# Altium schematic sheet 07_Hardware_ID.SchDoc: -
size A4; Date: -; ApprovedBy: -; CheckedBy: -; Author: -; CompanyName: -; DrawnBy: -; Engineer: -; Organization: Komax AG; Address1: -; Address2: -; Address3: -; Address4: -; DocumentNumber: -; Revision: -; SheetNumber: 7; SheetTotal: 8; KSDP_ObjectName: Hardware ID; KSDP_CreatedBy: Patrick Rossacher; KSDP_CreationDate: 20.12.2017; KSDP_ModificationDate: -; KSDP_ModifiedBy: -; CurrentTime: -; CurrentDate: -; Time: -; DocumentFullPathAndName: -; DocumentName: -; ModifiedDate: -; ImagePath: -
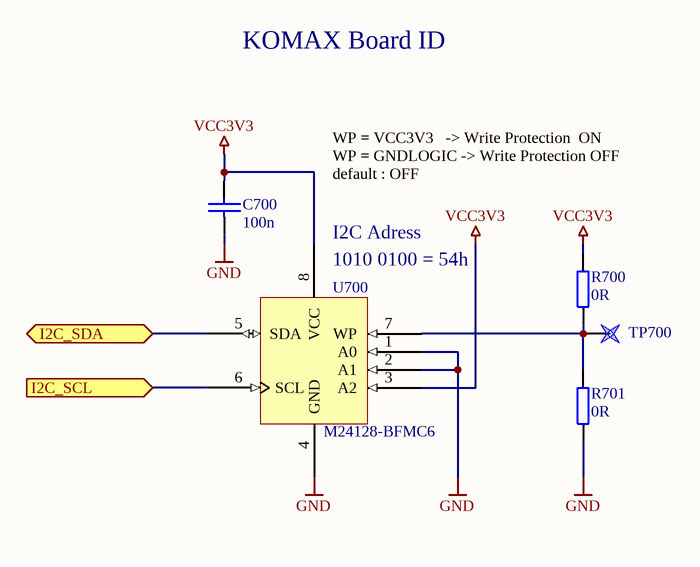
[diagram p0: 07_Hardware_ID.SchDoc]

## Parts
C700  100n  [0402_C]
R700  0R  [0402_R]
R701  0R  [0402_R]
TP700  Testpoint  [TP1.5MM]  (value not drawn)  (no BOM)
U700  M24128-BFMC6  [DFN-8-2x3]

## Ports
I2C_SCL (in), I2C_SDA (bidir)

## Nets
GND: C700.1 R701.1 U700.1(A0) U700.2(A1) U700.4(GND)
VCC3V3: C700.2 R700.2 U700.3(A2) U700.8(VCC)
I2C_SCL: U700.6(SCL) ; port I2C_SCL
I2C_SDA: U700.5(SDA) ; port I2C_SDA
NetR700_1: R700.1 R701.2 TP700.1 U700.7(WP)

## Notes on the sheet
- KOMAX Board ID
- WP = VCC3V3   -> Write Protection  ON
  WP = GNDLOGIC -> Write Protection OFF
  default : OFF
- (near U700) I2C Adress
- (near U700) 1010 0100 = 54h
- Project:
- ArtNo_Variant:
- Object:
- Creation Date:
- Modification Date:
- Created By:
- Modified By:
- DocNo:
- Index:
- Size, Template:
- A4, K_A4_V0006.SchDot
- Komax AG
  Industriestrasse 6
  CH-6036 Dierikon/LU
  Switzerland
- Print Date:
- File:
- Sheet
- of

## Library data of the parts
C700 = Cap: Ceramic Capacitor >=50V X7R; FootprintBOM: 0402
R700 R701 = RES2: Resistor 0.063W 1%; FootprintBOM: 0402
TP700 = P_PRUEFPAD: FootprintBOM: Testpoint
U700 = 24LC024: I2C Eeprom 128kBit; Manufacturer: ST Microelectronics; 2ndSourcesReleased: AT24C128C-MAHM-E; FootprintBOM: 8-UFDFN